# EAGLE design interface_circuit (EAGLE 9.6.2)
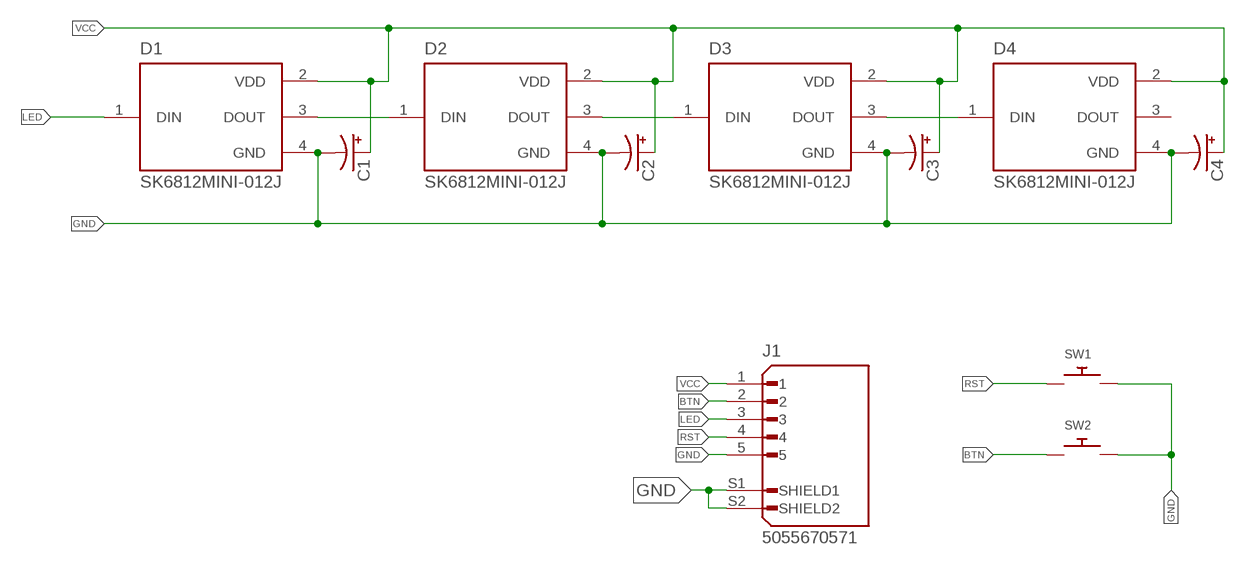
[diagram p0: schematic, sheet 1]

## Parts
C1  CAP_POL1206  [EIA3216]
C2  CAP_POL1206  [EIA3216]
C3  CAP_POL1206  [EIA3216]
C4  CAP_POL1206  [EIA3216]
D1  SK6812MINI-012J  [LED_SK6812MINI-012]
D2  SK6812MINI-012J  [LED_SK6812MINI-012]
D3  SK6812MINI-012J  [LED_SK6812MINI-012]
D4  SK6812MINI-012J  [LED_SK6812MINI-012]
J1  5055670571  [MOLEX_5055670571]
SW1  SWITCH_PUSHBUTTONSOFTTOUCHSMD_SJ  [PUSHBUTTON_SMD_SJ]
SW2  SWITCH_PUSHBUTTONSOFTTOUCHSMD_SJ  [PUSHBUTTON_SMD_SJ]

## Nets
BTN: J1.2 SW2.P$1
GND: C1.C(-) C2.C(-) C3.C(-) C4.C(-) D1.4(GND) D2.4(GND) D3.4(GND) D4.4(GND) J1.5 J1.S1(SHIELD1) J1.S2(SHIELD2) SW1.P$2 SW2.P$2
LED: D1.1(DIN) J1.3
N$2: D1.3(DOUT) D2.1(DIN)
N$3: D2.3(DOUT) D3.1(DIN)
N$4: D3.3(DOUT) D4.1(DIN)
RST: J1.4 SW1.P$1
VCC: C1.A(+) C2.A(+) C3.A(+) C4.A(+) D1.2(VDD) D2.2(VDD) D3.2(VDD) D4.2(VDD) J1.1
Unconnected: D4.3(DOUT)

## Library data of the parts
C1-C4 = SparkFun:CAP_POL: Capacitor Polarized These are standard SMD and PTH capacitors. Normally 10uF, 47uF, and 100uF in electrolytic and tantalum varieties. Always verify the external diameter of the through hole cap, it varies with capacity, voltage, and manufacturer. The EIA devices should be standard.
D1-D4 = SK6812MINI-012:SK6812MINI-012: Check availability <https://pricing.snapeda.com/parts/SK6812MINI-012/DONGGUANG%20OPSCO%20OPTOELECTRONICS%20CO.%2C%20LTD/view-part?ref=eda>; AVAILABILITY: Not in stock; CHECK_PRICES: https://www.snapeda.com/parts/SK6812MINI-012/DONGGUANG+OPSCO+OPTOELECTRONICS+CO.%252C+LTD/view-part/?ref=eda; DESCRIPTION: INTEGRATED LIGHT SOURCE INTELLIGENT CONTROL OF CHIP-ON-TOP SMD TYPE LED; MF: DONGGUANG OPSCO OPTOELECTRONICS CO., LTD; MP: SK6812MINI-012; PACKAGE: Package; PRICE: None; SNAPEDA_LINK: https://www.snapeda.com/parts/SK6812MINI-012/DONGGUANG+OPSCO+OPTOELECTRONICS+CO.%252C+LTD/view-part/?ref=snap
J1 = 5055670571:5055670571: 1.25mm Pitch, Micro-Lock Plus PCB Header, Right-Angle, Surface Mount, 0.38µm Gold Plating, Positive Lock, 5 Circuits, Black; MANUFACTURER: Molex; MAXIMUM_PACKAGE_HEIGHT: 3.9 mm; PARTREV: C; STANDARD: Manufacturer Recommendations
SW1 SW2 = adafruit:SWITCH_PUSHBUTTON: Buttons SOFTTOUCHSMD_SJ - Soft touch temporary push button (Super Junk Akihabara) Compatible with SKPMANE010 [Mouser: 688-SKPMAN] C&K_KSS = Digikey: KSS221GLFS

## Board
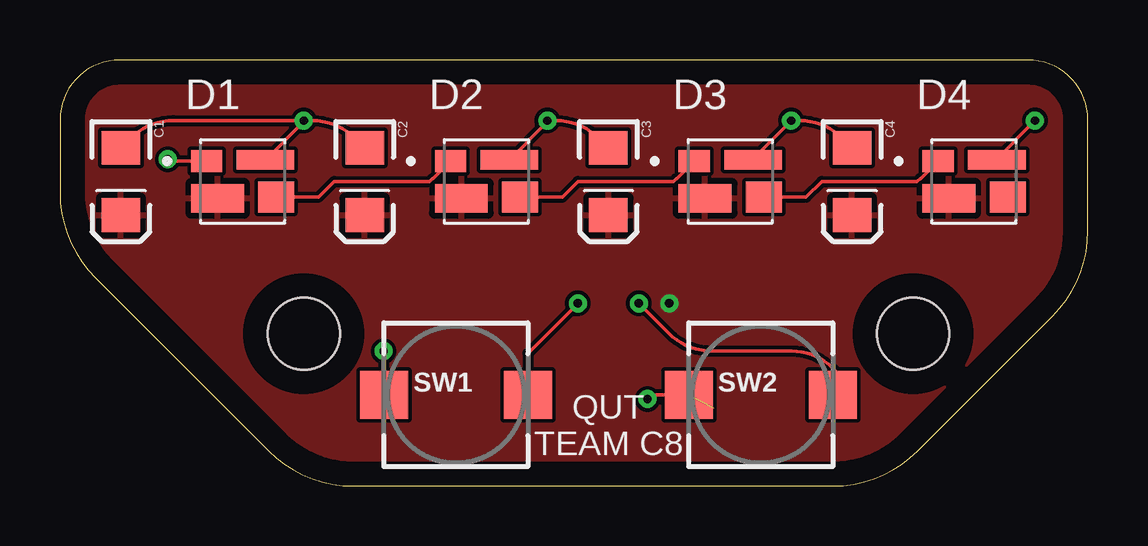
[diagram p1: board, top side]
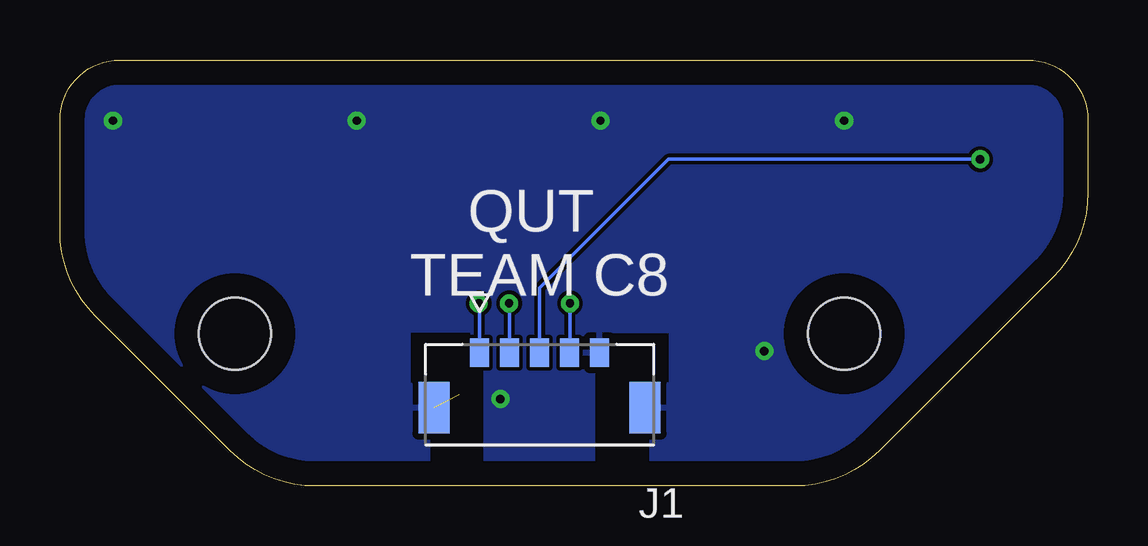
[diagram p2: board, bottom side, seen from below]

Size 42.85 x 17.77 mm. Coordinates in mm from the lower left corner, seen from the top.
Outline: 42.85,10.63 42.85,15.27 arc90 40.35,17.77 2.5,17.77 arc90 0,15.27 0,12.23 arc45 1.46,8.7 8.7,1.46 arc45 12.23,0 32.22,0 arc45 35.75,1.46 41.39,7.1 arc45 42.85,10.63
Copper layers (1*16): Top 0.035mm / dielectric 1.5mm / Bottom 0.035mm
Design rules "default": minimum track width 6mil, minimum drill 0.35mm, track to track 6mil, track to pad 6mil, pad to pad 6mil, via to via 6mil, smd to smd 6mil, copper to edge 40mil, drill to drill 6mil, minimum pad ring 10mil, minimum via ring 8mil, stop-mask expansion 4mil, vias tented up to drill 0mil, thermal gap 10mil
Holes 3 mm at 10.16,6.35 35.56,6.35

### Footprints (pad centres in the part's own frame; a part is rotated, then mirrored left to right if it is on the bottom)
EIA3216 = smd 1.4 x 1.6: A 1.4,0; C -1.4,0
LED_SK6812MINI-012 = smd 1.3 x 0.9: 1 -1.5,0.85 | smd 2.2 x 1.2: 2 -1.05,-0.7 | smd 1.5 x 1.3: 3 1.4,-0.65 | smd 2.4 x 0.8: 4 0.95,0.9
MOLEX_5055670571 = smd 0.8 x 1.2: 1 2.5,-1.75; 2 1.25,-1.75; 3 0,-1.75; 4 -1.25,-1.75; 5 -2.5,-1.75 | smd 1.3 x 2.15: S1 -4.4,0.545; S2 4.4,0.545
PUSHBUTTON_SMD_SJ = smd 2 x 2: P$1 3,0; P$2 -3,0

### Placement (x,y rotation side)
C1  2.54,12.7 270 top
C2  12.7,12.7 270 top
C3  22.86,12.7 270 top
C4  33.02,12.7 270 top
D1  7.62,12.7 0 top
D2  17.78,12.7 0 top
D3  27.94,12.7 0 top
D4  38.1,12.7 0 top
J1  22.86,3.81 180 bottom
SW1  16.51,3.81 0 top
SW2  29.21,3.81 0 top

### Tracks (layer width: path | path; a pad name or v marks a point on that pad's centre or on a via)
BTN  (via drill 0.35)
  Top 0.152: v24.13,7.62 25.38,6.37 arc45 27.17,5.63 30.49,5.63 arc-45 32.2,4.92 32.49,4.63 32.49,4.49 arc-45 SW2.P$1
  Bottom 0.152: J1.2 24.11,7.6 v24.13,7.62
GND  (via drill 0.35)  (1 unrouted)
  Top 0.152: C1.C 2.94,14.5 arc-45 4.73,15.24 v10.16,15.24 | D1.4 10.12,15.16 arc45 v10.16,15.24 | v10.16,15.24 10.51,15.24 arc-45 12.3,14.5 C2.C | D2.4 20.29,15.16 arc45 v20.32,15.24 20.67,15.24 arc-45 22.46,14.5 C3.C | D3.4 arc-45 28.93,13.69 v30.48,15.24 30.83,15.24 arc-45 32.62,14.5 C4.C | v40.64,15.24 39.08,13.69 arc45 D4.4 | v13.49,5.63 13.49,3.86 arc45 SW1.P$2 | v24.49,3.63 arc-45 24.93,3.81 SW2.P$2
  pour Bottom: -1.27,17.78 -1.27,-0.04 arc90 1.23,-2.54 44.45,-2.54 44.45,16.55 arc90 41.95,19.05 -1.27,19.05
LED  (via drill 0.35)
  Top 0.152: D1.1 4.57,13.55 v4.49,13.63
  Bottom 0.152: v4.49,13.63 17.49,13.63 22.86,8.26 J1.3
N$2
  Top 0.152: D1.3 10.78,12.05 11.43,12.7 15.41,12.7 15.54,12.83 15.56,12.83 D2.1
N$3
  Top 0.152: D2.3 20.94,12.05 21.59,12.7 25.57,12.7 25.69,12.83 25.72,12.83 D3.1
N$4
  Top 0.152: D3.3 31.1,12.05 31.75,12.7 35.73,12.7 35.86,12.83 35.88,12.83 D4.1
RST  (via drill 0.35)
  Top 0.152: v21.59,7.62 19.51,5.54 SW1.P$1
  Bottom 0.152: J1.4 21.59,5.58 v21.59,7.62
VCC  (via drill 0.35)
  Bottom 0.152: J1.1 25.36,7.58 v25.4,7.62
  pour Top: -1.27,19.05 -1.27,-0.04 arc90 1.23,-2.54 43.18,-2.54 arc90 44.45,-1.27 44.45,19.05 0,19.05

### Text on the board
tPlace: QUT / TEAM C8
bPlace: QUT / TEAM C8